# EasyEDA Pro project ProPrj_STC电调(AM32固件移植).epro

# Schematic v1.0
Board Name: am32ai8051u; Create Date: 2025-01-12; Page Name: P1; Project Name: STC电调(AM32固件移植); Schematic Name: v1.0; Update Date: 2025-01-12; Company: 嘉立创EDA; Page Size: A4; Version: V1.0
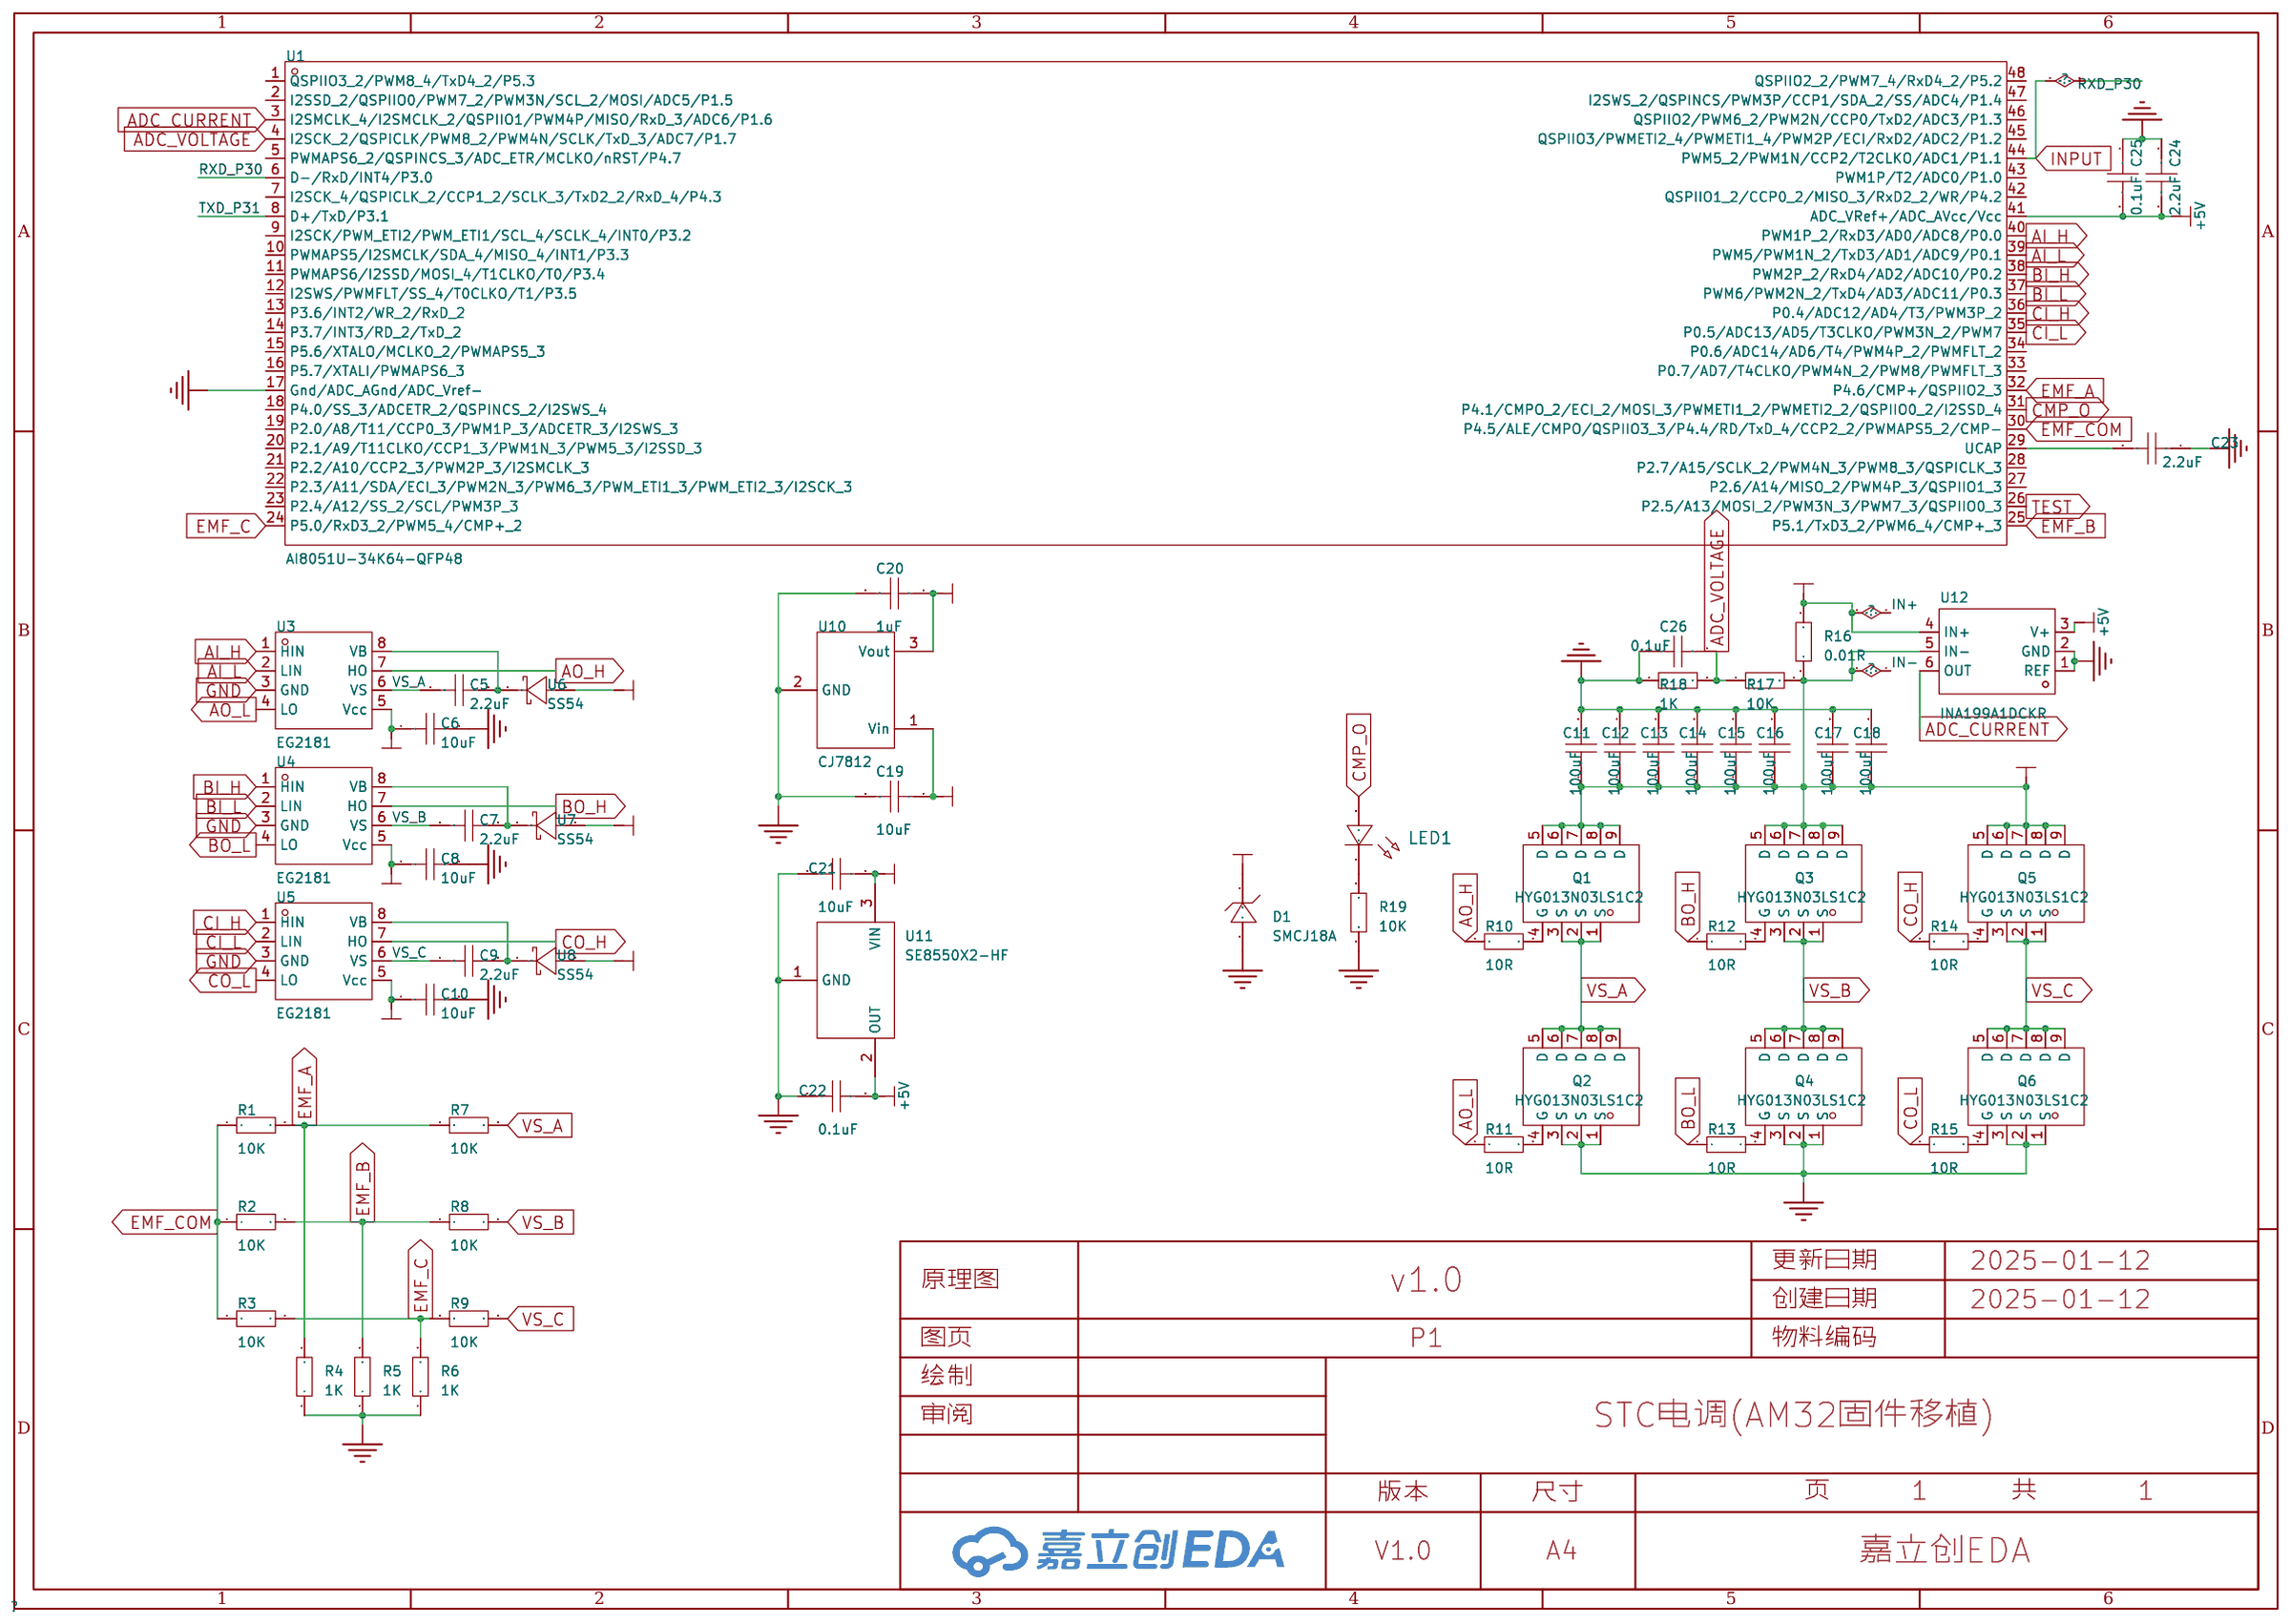
[diagram p0: schematic sheet]

## Parts
C5  2.2uF  [C0603]
C6  10uF  [C0603]
C7  2.2uF  [C0603]
C8  10uF  [C0603]
C9  2.2uF  [C0603]
C10  10uF  [C0603]
C11  100uF  [C1206]
C12  100uF  [C1206]
C13  100uF  [C1206]
C14  100uF  [C1206]
C15  100uF  [C1206]
C16  100uF  [C1206]
C17  100uF  [C1206]
C18  100uF  [C1206]
C19  10uF  [C0603]
C20  1uF  [C0603]
C21  10uF  [C0603]
C22  0.1uF  [C0603]
C23  2.2uF  [C0603]
C24  2.2uF  [C0603]
C25  0.1uF  [C0603]
C26  0.1uF  [C0603]
D1  SMCJ18A  [SMC_L6.9-W5.9-LS7.9-RD]
LED1  -  [LED_0603]
Q1  HYG013N03LS1C2  [PDFN-8_L5.8-W5.1-P1.27-LS6.1-BL]
Q2  HYG013N03LS1C2  [PDFN-8_L5.8-W5.1-P1.27-LS6.1-BL]
Q3  HYG013N03LS1C2  [PDFN-8_L5.8-W5.1-P1.27-LS6.1-BL]
Q4  HYG013N03LS1C2  [PDFN-8_L5.8-W5.1-P1.27-LS6.1-BL]
Q5  HYG013N03LS1C2  [PDFN-8_L5.8-W5.1-P1.27-LS6.1-BL]
Q6  HYG013N03LS1C2  [PDFN-8_L5.8-W5.1-P1.27-LS6.1-BL]
R1  10K  [R0603]
R2  10K  [R0603]
R3  10K  [R0603]
R4  1K  [R0603]
R5  1K  [R0603]
R6  1K  [R0603]
R7  10K  [R0603]
R8  10K  [R0603]
R9  10K  [R0603]
R10  10R  [R0603]
R11  10R  [R0603]
R12  10R  [R0603]
R13  10R  [R0603]
R14  10R  [R0603]
R15  10R  [R0603]
R16  0.01R  [R2010]
R17  10K  [R0603]
R18  1K  [R0603]
R19  10K  [R0603]
U1  AI8051U-34K64-QFP48  [LQFP-48_L7.0-W7.0-P0.50-LS9.0-BL_1]
U3  EG2181  [SOP-8_L4.9-W3.9-P1.27-LS6.0-BL]
U4  EG2181  [SOP-8_L4.9-W3.9-P1.27-LS6.0-BL]
U5  EG2181  [SOP-8_L4.9-W3.9-P1.27-LS6.0-BL]
U6  SS54  [SMA_L4.2-W2.6-LS5.1-RD]
U7  SS54  [SMA_L4.2-W2.6-LS5.1-RD]
U8  SS54  [SMA_L4.2-W2.6-LS5.1-RD]
U10  CJ7812  [TO-252-3_L6.5-W5.8-P4.58-BL]
U11  SE8550X2-HF  [SOT-23-3_L2.9-W1.3-P1.90-LS2.4-BR]
U12  INA199A1DCKR  [SC-70-6_L2.2-W1.3-P0.65-LS2.1-BR]

## Library data of the parts
C5-C10 C19-C26 = CAP_0603: Supplier Footprint: 0603
C11-C18 = CAP_1206: Supplier Footprint: 1206
D1 = SMCJ18A: 极性:单向;反向截止电压(Vrwm):18V;最大钳位电压:29.2V;峰值脉冲电流(Ipp):51.4A;峰值脉冲功率(Ppp):1.5kW;击穿电压:20V;; LCSC Part Name: TVS 18V截止 51.4A峰值脉冲; Supplier Part: C374030; Manufacturer: Littelfuse(美国力特); Supplier Footprint: DO-214AB(SMCJ); JLCPCB Part Class: 扩展库; Datasheet: https://atta.szlcsc.com/upload/public/pdf/source/20190918/C428836_E6B4B3834ADA1E56164A3D12F904E6C7.pdf; Supplier: LCSC; polarity: 单向; Reverse Stand-Off Voltage (Vrwm): 18V; Maximum Clamping Voltage: 29.2V; Peak Pulse Current (Ipp): 51.4A; Peak Pulse Power Dissipation (Ppp): 1.5kW; Breakdown Voltage: 20V; Type: TVS
LED1 = LED_0603-R: Supplier Footprint: 0603
Q1-Q6 = HYG013N03LS1C2: 类型:-;漏源电压(Vdss):30V;连续漏极电流(Id):150A;导通电阻(RDS(on)@Vgs,Id):2mΩ@4.5V,20A;功率:65W;阈值电压(Vgs(th)@Id):1V@250uA;; LCSC Part Name: 单通道N沟道MOSFET,电流:150A,耐压:30V; Supplier Part: C2763405; Manufacturer: HUAYI(华羿微); Supplier Footprint: PDFN-8(5.1x5.8); JLCPCB Part Class: 扩展库; Datasheet: https://atta.szlcsc.com/upload/public/pdf/source/20210326/C2763405_0A6080D7BBB9C26F30CE39A27C6AD564.pdf; Supplier: LCSC; Drain Source Voltage (Vdss): 30V; Continuous Drain Current (Id): 150A; Drain Source On Resistance (RDS(on)@Vgs,Id): 2mΩ@4.5V,20A; Power Dissipation (Pd): 65W; Gate Threshold Voltage (Vgs(th)@Id): 1V@250uA; Total Gate Charge (Qg@Vgs): 44.7nC@10V; Input Capacitance (Ciss@Vds): 3.011nF; Reverse Transfer Capacitance (Crss@Vds): 9.2pF@25V; Operating Temperature: -55℃~+175℃
R1-R15 R17-R19 = Res_0603: Supplier Footprint: 0603
R16 = Res_2010: Supplier Footprint: 2010
U1 = AI8051U-34K64-QFP48: 硬件浮点/硬件三角函数 跑100MHz, 32位8051-CPU 跑 42MHz，PWM 有硬件移相功能，DMA支持外设到外设，DMA支持PWM; Supplier Part: C41427635; Manufacturer: STC; Supplier Footprint: QFP-48; JLCPCB Part Class: 扩展库; Datasheet: https://atta.szlcsc.com/upload/public/pdf/source/20241012/98E0A3F17C9CC280218AE3F266CCDE47.pdf; Supplier: LCSC
U3-U5 = EG2181: Supplier Part: C459721; Manufacturer: EG(屹晶微); Supplier Footprint: SOP-8; JLCPCB Part Class: 扩展库; Datasheet: https://atta.szlcsc.com/upload/public/pdf/source/20191122/C459721_8DDE7F395482F041919AB19A4C4FD510.pdf; Supplier: LCSC
U6-U8 = SS54: Supplier Part: C9900023219; Supplier Footprint: (1N5824)DO-214; JLCPCB Part Class: 扩展库; Supplier: LCSC
U10 = CJ7812_C26184: 输出类型:固定;最大输入电压:35V;输出电压:12V;输出电流:1.5A;输出极性:正极;; LCSC Part Name: 输入35V 输出12V 1.5A; Supplier Part: C26184; Manufacturer: CJ(江苏长电/长晶); Supplier Footprint: TO-252-2; JLCPCB Part Class: 扩展库; Datasheet: https://atta.szlcsc.com/upload/public/pdf/source/20180412/C26184_C7F45D4504ECDF2F14935BA96F015906.pdf; Supplier: LCSC; Output Type: 固定; Maximum Input Voltage: 35V; Output Voltage: 12V; Output Current: 1.5A; Dropout Voltage: 2V@(1A); Output Polarity: 正极; Number of Outputs: 1
U11 = SE8550X2-HF: 输出类型:固定;最大输入电压:40V;输出电压:5V;最大输出电流:250mA;电源纹波抑制比(PSRR):85dB;输出极性:正极;; LCSC Part Name: 输入40V 输出5V 250mA; Supplier Part: C115015; Manufacturer: SEAWARD(思旺); Supplier Footprint: SOT-23; JLCPCB Part Class: 扩展库; Datasheet: https://atta.szlcsc.com/upload/public/pdf/source/20221228/060EFB5038ABEFFCA582915343CD15E2.pdf; Supplier: LCSC; Output Type: 固定; Maximum Input Voltage: 40V; Output Voltage: 5V; MAX Output Current: 250mA; Power Supply Rejection Ratio (PSRR): 85dB; Dropout Voltage: 600mV@(200mA); standby current: 2uA; Output Polarity: 正极; Number of Outputs: 1
U12 = INA199A1DCKR: INA199 26V、双向电流感应放大器; Supplier Part: C59135; Manufacturer: TI(德州仪器); Supplier Footprint: SOT-363(SC-70-6); JLCPCB Part Class: 扩展库; Datasheet: https://www.ti.com/cn/lit/gpn/ina199; Supplier: LCSC; Supply Voltage: -300mV~26V; Supply Current: 300uA; Operating Temperature: -40℃~+125℃

## Nets
+5V: C22.2 C24.2 C25.2 U1.41(ADC_VRef+/ADC_AVcc/Vcc) U11.2(OUT) U12.3(V+)
+12V: C6.1 C8.1 C10.1 C20.1 C21.1 U3.5(Vcc) U4.5(Vcc) U5.5(Vcc) U6.2(A) U7.2(A) U8.2(A) U10.3(Vout) U11.3(VIN)
GND: C6.2 C8.2 C10.2 C11.2 C12.2 C13.2 C14.2 C15.2 C16.2 C17.2 C18.2 C19.2 C20.2 C21.2 C22.1 C23.1 C24.1 C25.1 C26.1 D1.2(A) Q2.1(S) Q2.2(S) Q2.3(S) Q4.1(S) Q4.2(S) Q4.3(S) Q6.1(S) Q6.2(S) Q6.3(S) R4.1 R5.1 R6.1 R18.1 R19.1 U1.17(Gnd/ADC_AGnd/ADC_Vref-) U3.3(GND) U4.3(GND) U5.3(GND) U10.2(GND) U11.1(GND) U12.1(REF) U12.2(GND)
VBAT: C19.1 R16.1 U10.1(Vin) U12.4(IN+)
ADC_CURRENT: U1.3(I2SMCLK_4/I2SMCLK_2/QSPIIO1/PWM4P/MISO/RxD_3/ADC6/P1.6) U12.6(OUT)
ADC_VOLTAGE: C26.2 R17.1 R18.2 U1.4(I2SCK_2/QSPICLK/PWM8_2/PWM4N/SCLK/TxD_3/ADC7/P1.7)
AI_H: U1.40(PWM1P_2/RxD3/AD0/ADC8/P0.0) U3.1(HIN)
AI_L: U1.39(PWM5/PWM1N_2/TxD3/AD1/ADC9/P0.1) U3.2(LIN)
AO_H: R10.1 U3.7(HO)
AO_L: R11.1 U3.4(LO)
BI_H: U1.38(PWM2P_2/RxD4/AD2/ADC10/P0.2) U4.1(HIN)
BI_L: U1.37(PWM6/PWM2N_2/TxD4/AD3/ADC11/P0.3) U4.2(LIN)
BO_H: R12.1 U4.7(HO)
BO_L: R13.1 U4.4(LO)
CI_H: U1.36(P0.4/ADC12/AD4/T3/PWM3P_2) U5.1(HIN)
CI_L: U1.35(P0.5/ADC13/AD5/T3CLKO/PWM3N_2/PWM7) U5.2(LIN)
CMP_O: LED1.2(A) U1.31(P4.1/CMPO_2/ECI_2/MOSI_3/PWMETI1_2/PWMETI2_2/QSPIIO0_2/I2SSD_4)
CO_H: R14.1 U5.7(HO)
CO_L: R15.1 U5.4(LO)
EMF_A: R1.2 R4.2 R7.1 U1.32(P4.6/CMP+/QSPIIO2_3)
EMF_B: R2.2 R5.2 R8.1 U1.25(P5.1/TxD3_2/PWM6_4/CMP+_3)
EMF_C: R3.2 R6.2 R9.1 U1.24(P5.0/RxD3_2/PWM5_4/CMP+_2)
EMF_COM: R1.1 R2.1 R3.1 U1.30(P4.5/ALE/CMPO/QSPIIO3_3/P4.4/RD/TxD_4/CCP2_2/PWMAPS5_2/CMP-)
INPUT: U1.6(D-/RxD/INT4/P3.0) U1.44(PWM5_2/PWM1N/CCP2/T2CLKO/ADC1/P1.1)
TEST: U1.26(P2.5/A13/MOSI_2/PWM3N_3/PWM7_3/QSPIIO0_3)
TXD_P31: U1.8(D+/TxD/P3.1)
V_MOS: C11.1 C12.1 C13.1 C14.1 C15.1 C16.1 C17.1 C18.1 D1.1(C) Q1.5(D) Q1.6(D) Q1.7(D) Q1.8(D) Q1.9(D) Q3.5(D) Q3.6(D) Q3.7(D) Q3.8(D) Q3.9(D) Q5.5(D) Q5.6(D) Q5.7(D) Q5.8(D) Q5.9(D) R16.2 R17.2 U12.5(IN-)
VS_A: C5.1 Q1.1(S) Q1.2(S) Q1.3(S) Q2.5(D) Q2.6(D) Q2.7(D) Q2.8(D) Q2.9(D) R7.2 U3.6(VS)
VS_B: C7.1 Q3.1(S) Q3.2(S) Q3.3(S) Q4.5(D) Q4.6(D) Q4.7(D) Q4.8(D) Q4.9(D) R8.2 U4.6(VS)
VS_C: C9.1 Q5.1(S) Q5.2(S) Q5.3(S) Q6.5(D) Q6.6(D) Q6.7(D) Q6.8(D) Q6.9(D) R9.2 U5.6(VS)
$1N3291: Q2.4(G) R11.2
$1N3317: Q4.4(G) R13.2
$1N3367: Q6.4(G) R15.2
$1N3393: Q1.4(G) R10.2
$1N3419: Q3.4(G) R12.2
$1N3445: Q5.4(G) R14.2
$1N6248: C7.2 U4.8(VB) U7.1(C)
$1N6352: C9.2 U5.8(VB) U8.1(C)
$1N7183: C23.2 U1.29(UCAP)
$1N9300: C5.2 U3.8(VB) U6.1(C)
$1N11107: LED1.1(C) R19.2

Not connected (* = marked no-connect by the designer): U1 1(QSPIIO3_2/PWM8_4/TxD4_2/P5.3) 2(I2SSD_2/QSPIIO0/PWM7_2/PWM3N/SCL_2/MOSI/ADC5/P1.5) 5(PWMAPS6_2/QSPINCS_3/ADC_ETR/MCLKO/nRST/P4.7) 7(I2SCK_4/QSPICLK_2/CCP1_2/SCLK_3/TxD2_2/RxD_4/P4.3) 9(I2SCK/PWM_ETI2/PWM_ETI1/SCL_4/SCLK_4/INT0/P3.2) 10(PWMAPS5/I2SMCLK/SDA_4/MISO_4/INT1/P3.3) 11(PWMAPS6/I2SSD/MOSI_4/T1CLKO/T0/P3.4) 12(I2SWS/PWMFLT/SS_4/T0CLKO/T1/P3.5) 13(P3.6/INT2/WR_2/RxD_2) 14(P3.7/INT3/RD_2/TxD_2) 15(P5.6/XTALO/MCLKO_2/PWMAPS5_3) 16(P5.7/XTALI/PWMAPS6_3) 18(P4.0/SS_3/ADCETR_2/QSPINCS_2/I2SWS_4) 19(P2.0/A8/T11/CCP0_3/PWM1P_3/ADCETR_3/I2SWS_3) 20(P2.1/A9/T11CLKO/CCP1_3/PWM1N_3/PWM5_3/I2SSD_3) 21(P2.2/A10/CCP2_3/PWM2P_3/I2SMCLK_3) 22(P2.3/A11/SDA/ECI_3/PWM2N_3/PWM6_3/PWM_ETI1_3/PWM_ETI2_3/I2SCK_3) 23(P2.4/A12/SS_2/SCL/PWM3P_3) 27(P2.6/A14/MISO_2/PWM4P_3/QSPIIO1_3) 28(P2.7/A15/SCLK_2/PWM4N_3/PWM8_3/QSPICLK_3) 33(P0.7/AD7/T4CLKO/PWM4N_2/PWM8/PWMFLT_3) 34(P0.6/ADC14/AD6/T4/PWM4P_2/PWMFLT_2) 42(QSPIIO1_2/CCP0_2/MISO_3/RxD2_2/WR/P4.2) 43(PWM1P/T2/ADC0/P1.0) 45(QSPIIO3/PWMETI2_4/PWMETI1_4/PWM2P/ECI/RxD2/ADC2/P1.2) 46(QSPIIO2/PWM6_2/PWM2N/CCP0/TxD2/ADC3/P1.3) 47(I2SWS_2/QSPINCS/PWM3P/CCP1/SDA_2/SS/ADC4/P1.4) 48(QSPIIO2_2/PWM7_4/RxD4_2/P5.2)

# Board v1.0
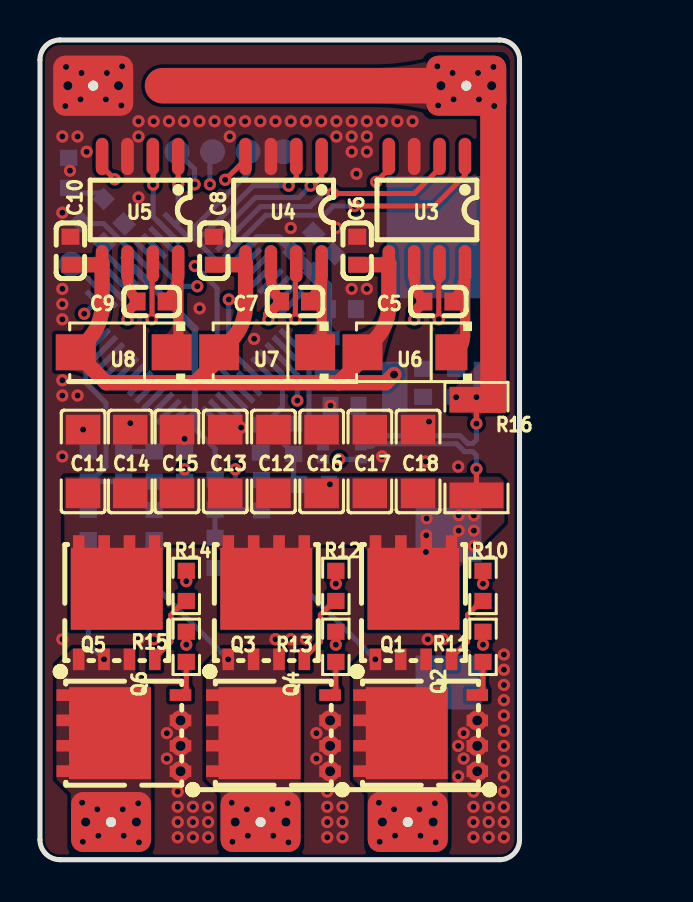
[diagram p1: board, top side]
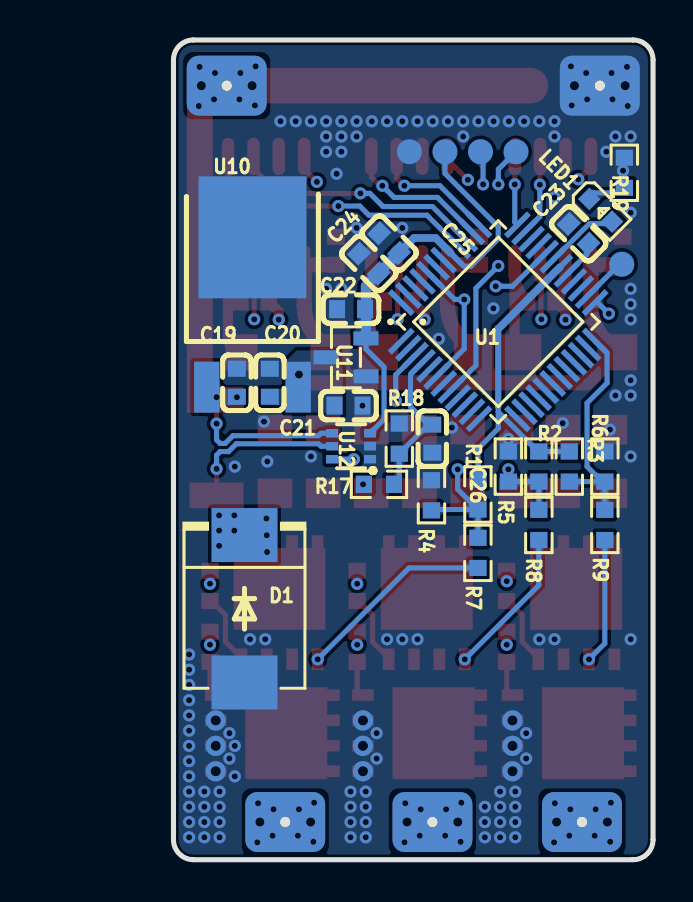
[diagram p2: board, bottom side, seen from below]

Outline 24 x 41 mm; copper layers: Top Layer, Inner1, Inner2, Bottom Layer. Coordinates in mm from the lower left corner of the outline.
Outline path: 0,40 0,1 arc(0.29,0.29) 1,0 23,0 arc(23.71,0.29) 24,1 24,40 arc(23.71,40.71) 23,41 1,41 arc(0.29,40.71) 0,40
Stack: Top Layer 0.035mm 外层铜厚1oz / Dielectric1 0.2104mm 7628 RC49% 8.6mil / Inner1 0.0152mm 内层铜厚 / Dielectric2 1.065mm 1.1mm H/HOZ Copper / Inner2 0.0152mm 内层铜厚 / Dielectric3 0.2104mm 7628 RC49% 8.6mil / Bottom Layer 0.035mm 外层铜厚1oz

## Design rules (mm)
template: 用户自定义配置
spacing copperThickness1oz (default): track to track 0.102, other pairs 0.152 to 0.3
spacing copperThickness2oz: track to track 0.203, other pairs 0.152 to 0.3
track width copperThickness1oz (default): min 0.127, default 0.254, max 2.54
track width copperThickness2oz: min 0.203, default 0.254, max 2.54
differential pair differentialPair (default): width min 0.127, default 0.254, max 2.54; gap min 0.152, default 0.152
via viaSize (default): diameter min 0.5, default 0.61, max 10; hole min 0.3, default 0.305, max 6.299

## Placement (name value [footprint] x y rotation side)
C5  2.2uF  [C0603]  19.94 27.92 0 top
C6  10uF  [C0603]  15.88 30.46 90 top
C7  2.2uF  [C0603]  12.77 27.92 0 top
C8  10uF  [C0603]  8.7 30.46 90 top
C9  2.2uF  [C0603]  5.59 27.92 0 top
C10  10uF  [C0603]  1.52 30.46 90 top
C11  100uF  [C1206]  2.16 19.92 90 top
C12  100uF  [C1206]  11.68 19.92 90 top
C13  100uF  [C1206]  9.27 19.92 90 top
C14  100uF  [C1206]  4.52 19.92 90 top
C15  100uF  [C1206]  6.86 19.92 90 top
C16  100uF  [C1206]  14.1 19.92 90 top
C17  100uF  [C1206]  16.51 19.92 90 top
C18  100uF  [C1206]  18.92 19.92 90 top
C19  10uF  [C0603]  20.83 23.85 90 bottom
C20  1uF  [C0603]  19.18 23.85 90 bottom
C21  10uF  [C0603]  15.24 22.71 180 bottom
C22  0.1uF  [C0603]  15.11 27.54 180 bottom
C23  2.2uF  [C0603]  3.72 31.31 225 bottom
C24  2.2uF  [C0603]  14.22 29.82 225 bottom
C25  0.1uF  [C0603]  13.21 30.84 225 bottom
C26  0.1uF  [C0603]  11.05 21.06 90 bottom
D1  SMCJ18A  [SMC_L6.9-W5.9-LS7.9-RD]  20.45 12.55 270 bottom
LED1  -  [LED_0603]  2.58 32.45 225 bottom
NOREF  -  [Pad_e2281]  21.34 38.71 0 top
NOREF#2  -  [Pad_e2202]  22.68 30.35 180 top
NOREF#3  -  [Pad_e1605]  6.86 35.41 180 top
NOREF#4  -  [Pad_e1625]  8.64 35.41 180 top
NOREF#5  -  [Pad_e1356]  3.56 1.88 0 top
NOREF#6  -  [Pad_e1747]  12.19 35.41 180 top
NOREF#7  -  [Pad_e2259]  2.66 38.71 180 top
NOREF#8  -  [Pad_e1699]  10.41 35.41 180 top
NOREF#9  -  [Pad_e1433]  11.04 1.88 0 top
NOREF#10  -  [Pad_e11]  1.56 29.78 180 top
NOREF#11  -  [Pad_e1444]  18.41 1.88 0 top
Q1  HYG013N03LS1C2  [PDFN-8_L5.8-W5.1-P1.27-LS6.1-BL]  18.69 12.86 0 top
Q2  HYG013N03LS1C2  [PDFN-8_L5.8-W5.1-P1.27-LS6.1-BL]  19.05 6.33 90 top
Q3  HYG013N03LS1C2  [PDFN-8_L5.8-W5.1-P1.27-LS6.1-BL]  11.33 12.86 0 top
Q4  HYG013N03LS1C2  [PDFN-8_L5.8-W5.1-P1.27-LS6.1-BL]  11.68 6.33 90 top
Q5  HYG013N03LS1C2  [PDFN-8_L5.8-W5.1-P1.27-LS6.1-BL]  3.84 12.86 0 top
Q6  HYG013N03LS1C2  [PDFN-8_L5.8-W5.1-P1.27-LS6.1-BL]  4.2 6.33 90 top
R1  10K  [R0603]  8.76 18.27 270 bottom
R2  10K  [R0603]  5.72 19.66 270 bottom
R3  10K  [R0603]  4.19 19.66 270 bottom
R4  1K  [R0603]  11.09 18.23 270 bottom
R5  1K  [R0603]  7.24 19.66 270 bottom
R6  1K  [R0603]  2.41 19.66 270 bottom
R7  10K  [R0603]  8.76 15.35 270 bottom
R8  10K  [R0603]  5.72 16.74 270 bottom
R9  10K  [R0603]  2.41 16.74 270 bottom
R10  10R  [R0603]  22.17 13.69 270 top
R11  10R  [R0603]  22.17 10.65 270 top
R12  10R  [R0603]  14.81 13.69 270 top
R13  10R  [R0603]  14.81 10.65 270 top
R14  10R  [R0603]  7.32 13.69 270 top
R15  10R  [R0603]  7.32 10.65 270 top
R16  0.01R  [R2010]  21.84 20.62 270 top
R17  10K  [R0603]  13.72 18.77 0 bottom
R18  1K  [R0603]  12.7 21.06 270 bottom
R19  10K  [R0603]  1.44 34.36 270 bottom
U1  AI8051U-34K64-QFP48  [LQFP-48_L7.0-W7.0-P0.50-LS9.0-BL_1]  7.75 26.9 225 bottom
U3  EG2181  [SOP-8_L4.9-W3.9-P1.27-LS6.0-BL]  19.37 32.49 180 top
U4  EG2181  [SOP-8_L4.9-W3.9-P1.27-LS6.0-BL]  12.19 32.49 180 top
U5  EG2181  [SOP-8_L4.9-W3.9-P1.27-LS6.0-BL]  5.01 32.49 180 top
U6  SS54  [SMA_L4.2-W2.6-LS5.1-RD#2]  18.54 25.38 180 top
U7  SS54  [SMA_L4.2-W2.6-LS5.1-RD]  11.37 25.38 180 top
U8  SS54  [SMA_L4.2-W2.6-LS5.1-RD]  4.19 25.38 180 top
U10  CJ7812  [TO-252-3_L6.5-W5.8-P4.58-BL]  20.05 27.38 180 bottom
U11  SE8550X2-HF  [SOT-23-3_L2.9-W1.3-P1.90-LS2.4-BR]  15.37 25.12 180 bottom
U12  INA199A1DCKR  [SC-70-6_L2.2-W1.3-P0.65-LS2.1-BR]  15.11 20.68 180 bottom

## Footprints (pads in the part's own frame, mm; a bottom-side part is the same pattern mirrored in y, then rotated)
C0603
  rect 0.8x0.9 smd: 1(-0.7,0) 2(0.7,0)
C1206
  rect 1.485x1.728 smd: 1(-1.593,0) 2(1.593,0)
LED_0603
  rect 0.8x0.8 smd: 1(-0.851,-0.01) 2(0.75,-0.005)
LQFP-48_L7.0-W7.0-P0.50-LS9.0-BL_1
  rect 0.28x1.62 smd: 1(-2.75,-4.11) 2(-2.25,-4.11) 3(-1.75,-4.11) 4(-1.25,-4.11) 5(-0.75,-4.11) 6(-0.25,-4.11) 7(0.25,-4.11) 8(0.75,-4.11) 9(1.25,-4.11) 10(1.75,-4.11) 11(2.25,-4.11) 12(2.75,-4.11) 25(2.75,4.11) 26(2.25,4.11) 27(1.75,4.11) 28(1.25,4.11) 29(0.75,4.11) 30(0.25,4.11) 31(-0.25,4.11) 32(-0.75,4.11) 33(-1.25,4.11) 34(-1.75,4.11) 35(-2.25,4.11) 36(-2.75,4.11)
  rect 1.62x0.28 smd: 13(4.11,-2.75) 14(4.11,-2.25) 15(4.11,-1.75) 16(4.11,-1.25) 17(4.11,-0.75) 18(4.11,-0.25) 19(4.11,0.25) 20(4.11,0.75) 21(4.11,1.25) 22(4.11,1.75) 23(4.11,2.25) 24(4.11,2.75) 37(-4.11,2.75) 38(-4.11,2.25) 39(-4.11,1.75) 40(-4.11,1.25) 41(-4.11,0.75) 42(-4.11,0.25) 43(-4.11,-0.25) 44(-4.11,-0.75) 45(-4.11,-1.25) 46(-4.11,-1.75) 47(-4.11,-2.25) 48(-4.11,-2.75)
Pad_e11
  round 1.25 smd far side: 1(0,0)
Pad_e1356
  rrect 4x3 hole 0.508: 1(0,0)
Pad_e1433
  rrect 4x3 hole 0.508: 1(0,0)
Pad_e1444
  rrect 4x3 hole 0.508: 1(0,0)
Pad_e1605
  round 1.25 smd far side: 1(0,0)
Pad_e1625
  round 1.25 smd far side: 1(0,0)
Pad_e1699
  round 1.25 smd far side: 1(0,0)
Pad_e1747
  round 1.25 smd far side: 1(0,0)
Pad_e2202
  rect 1.3x16 smd: 1(0,0)
Pad_e2259
  rrect 4x3 hole 0.508: 1(0,0)
Pad_e2281
  rrect 4x3 hole 0.508: 1(0,0)
PDFN-8_L5.8-W5.1-P1.27-LS6.1-BL
  rect 0.58x1.079 smd: 1(-1.905,-2.834) 2(-0.635,-2.834) 3(0.635,-2.834) 4(1.905,-2.834)
  rect 0.58x1.08 smd: 5(1.9,2.834) 6(0.64,2.834) 7(-0.63,2.834) 8(-1.9,2.834)
  rect 4.6x4.1 smd: 9(0,0.695)
R0603
  rect 0.806x0.864 smd: 1(-0.753,0) 2(0.753,0)
R2010
  rect 1.282x2.7 smd: 1(-2.391,0) 2(2.391,0)
SC-70-6_L2.2-W1.3-P0.65-LS2.1-BR
  rect 0.6x0.42 smd: 1(0.95,-0.65) 2(0.95,0) 3(0.95,0.65) 4(-0.95,0.65) 5(-0.95,0) 6(-0.95,-0.65)
SMA_L4.2-W2.6-LS5.1-RD
  rect 2x1.8 smd: 1(-2.4,0) 2(2.4,0)
SMA_L4.2-W2.6-LS5.1-RD#2
  rect 1.6x1.8 smd: 1(-2.051,0)
  rect 2x1.8 smd: 2(2.4,0)
SMC_L6.9-W5.9-LS7.9-RD
  rect 2.7x3.3 smd: 1(-3.687,0) 2(3.687,0)
SOP-8_L4.9-W3.9-P1.27-LS6.0-BL
  oval 0.63x1.865 smd: 1(-1.905,-2.683) 2(-0.635,-2.683) 3(0.635,-2.683) 4(1.905,-2.683) 5(1.905,2.683) 6(0.635,2.683) 7(-0.635,2.683) 8(-1.905,2.683)
SOT-23-3_L2.9-W1.3-P1.90-LS2.4-BR
  rect 1.25x0.7 smd: 1(1,-0.95) 2(1,0.95) 3(-1,0)
TO-252-3_L6.5-W5.8-P4.58-BL
  rect 1.27x2.54 smd: 1(-2.288,-3.747) 3(2.288,-3.745)
  rect 5.4x6.1 smd: 2(-0.002,3.747)

## Nets
+5V: C22.2 C24.2 C25.2 NOREF#8.1 U1.41 U11.2 U12.3
+12V: C6.1 C8.1 C10.1 C20.1 C21.1 U3.5 U4.5 U5.5 U6.2 U7.2 U8.2 U10.3 U11.3
GND: C6.2 C8.2 C10.2 C11.2 C12.2 C13.2 C14.2 C15.2 C16.2 C17.2 C18.2 C19.2 C20.2 C21.2 C22.1 C23.1 C24.1 C25.1 C26.1 D1.2 NOREF#6.1 NOREF#7.1 Q2.1 Q2.2 Q2.3 Q4.1 Q4.2 Q4.3 Q6.1 Q6.2 Q6.3 R4.1 R5.1 R6.1 R18.1 R19.1 U1.17 U3.3 U4.3 U5.3 U10.2 U11.1 U12.1 U12.2
VBAT: C19.1 NOREF.1 NOREF#2.1 R16.1 U10.1 U12.4
ADC_CURRENT: U1.3 U12.6
ADC_VOLTAGE: C26.2 R17.1 R18.2 U1.4
AI_H: U1.40 U3.1
AI_L: U1.39 U3.2
AO_H: R10.1 U3.7
AO_L: R11.1 U3.4
BI_H: U1.38 U4.1
BI_L: U1.37 U4.2
BO_H: R12.1 U4.7
BO_L: R13.1 U4.4
CI_H: U1.36 U5.1
CI_L: U1.35 U5.2
CMP_O: LED1.2 U1.31
CO_H: R14.1 U5.7
CO_L: R15.1 U5.4
EMF_A: R1.2 R4.2 R7.1 U1.32
EMF_B: R2.2 R5.2 R8.1 U1.25
EMF_C: R3.2 R6.2 R9.1 U1.24
EMF_COM: R1.1 R2.1 R3.1 U1.30
INPUT: NOREF#4.1 U1.6 U1.44
TEST: NOREF#10.1 U1.26
TXD_P31: NOREF#3.1 U1.8
V_MOS: C11.1 C12.1 C13.1 C14.1 C15.1 C16.1 C17.1 C18.1 D1.1 Q1.5 Q1.6 Q1.7 Q1.8 Q1.9 Q3.5 Q3.6 Q3.7 Q3.8 Q3.9 Q5.5 Q5.6 Q5.7 Q5.8 Q5.9 R16.2 R17.2 U12.5
VS_A: C5.1 NOREF#11.1 Q1.1 Q1.2 Q1.3 Q2.5 Q2.6 Q2.7 Q2.8 Q2.9 R7.2 U3.6
VS_B: C7.1 NOREF#9.1 Q3.1 Q3.2 Q3.3 Q4.5 Q4.6 Q4.7 Q4.8 Q4.9 R8.2 U4.6
VS_C: C9.1 NOREF#5.1 Q5.1 Q5.2 Q5.3 Q6.5 Q6.6 Q6.7 Q6.8 Q6.9 R9.2 U5.6
$1N3291: Q2.4 R11.2
$1N3317: Q4.4 R13.2
$1N3367: Q6.4 R15.2
$1N3393: Q1.4 R10.2
$1N3419: Q3.4 R12.2
$1N3445: Q5.4 R14.2
$1N6248: C7.2 U4.8 U7.1
$1N6352: C9.2 U5.8 U8.1
$1N7183: C23.2 U1.29
$1N9300: C5.2 U3.8 U6.1
$1N11107: LED1.1 R19.2

Pads without a net: U1 1 2 5 7 9 10 11 12 13 14 15 16 18 19 20 21 22 23 27 28 33 34 42 43 45 46 47 48

## Via types
v1: diameter 0.61, hole 0.305, Top Layer to Bottom Layer, 198 vias
v2: diameter 1.016, hole 0.508, Top Layer to Bottom Layer, 9 vias
v3: diameter 1.016, hole 0.457, Top Layer to Bottom Layer, 10 vias
v4: diameter 0.61, hole 0.4, Top Layer to Bottom Layer, 1 via

## Routing (per net, layer and track width the routed paths; a pad name or vN(x,y) marks a point on that pad's centre or on a via; arc(x,y) is an arc through that point)
+5V: length 22.3
  Bottom Layer w0.254: U11.2 14.37,25.54 13.46,24.64 13.46,22.03 U12.3 ; U1.41 9.47,29.69 9.11,29.69 7.75,31.05 7.75,31.66 10.41,34.33 NOREF#8.1
  Bottom Layer w0.381: 12.71,30.34 11.96,31.09 10.88,31.09 U1.41
  Bottom Layer w0.508: U11.2 14.37,28.69 12.71,30.34
+12V: length 40.1
  Top Layer w0.762: 14.95,23.85 16.14,25.05 ; 14.95,23.85 7.77,23.85 ; 14.95,23.85 17.31,23.85 v4(17.72,24.27) ; 8.7,29.76 10.17,29.76 arc(10.23,29.77) U4.5 10.29,27.75 arc(10.09,26.78) 9.54,25.95 U7.2 9.13,25.22 7.77,23.85 ; 7.77,23.85 3.31,23.85 U8.2 2.37,25.95 arc(2.92,26.78) 3.11,27.75 U5.5 arc(3.05,29.77) 2.99,29.76 1.52,29.76 ; 15.88,29.76 17.34,29.76 arc(17.41,29.77) U3.5 17.46,27.75 arc(17.27,26.78) 16.72,25.95 U6.2 16.14,25.26
GND:
  vias: v1(1.12,36.17) v1(1.12,32.36) v1(1.12,28.55) v1(1.12,27.79) v1(1.12,27.03) v1(1.12,23.98) v1(1.12,23.22) v1(1.12,20.17) v1(1.12,11.03) v1(1.27,37.7) v1(1.31,39.65) v1(1.5,34.46) v1(1.88,36.17) v1(1.88,23.22) v1(2.08,39.35) v1(2.03,38.03) v1(2.16,21.51) v1(2.34,35.41) v1(3.35,39.35) v1(3.3,38.03) v1(4.07,37.73) v1(4.11,39.68) v1(4.52,21.83) v1(4.93,36.93) v1(4.93,36.17) v1(4.93,33.12) v1(4.93,11.03) v1(5.69,36.93) v1(5.69,11.03) v1(6.35,6.33) v1(6.35,5.06) v1(6.45,36.93) v1(6.89,3.41) v1(6.89,2.64) v1(6.89,1.88) v1(6.89,1.12) v1(7.22,36.93) v1(7.24,21.05) v1(7.66,3.41) v1(7.66,2.64) v1(7.66,1.88) v1(7.66,1.12) v1(7.98,36.93) v1(7.99,27.58) v1(8.42,2.64) v1(8.42,1.88) v1(8.42,1.12) v1(8.74,36.93) v1(9.5,36.93) v1(9.5,36.17) v1(10.07,21.61) v1(10.26,36.93) v1(10.72,26.05) v1(11.03,36.93) v1(11.79,36.93) v1(11.79,11.03) v1(12.55,36.93) v1(12.55,31.6) v1(12.55,11.03) v1(13.31,36.93) v1(13.31,11.03) v1(13.83,6.33) v1(13.83,5.06) v1(14.07,36.93) v1(14.38,3.41) v1(14.38,2.64) v1(14.38,1.88) v1(14.38,1.12) v1(14.54,22.71) v1(14.84,36.93) v1(14.84,36.17) v1(14.84,31.6) v1(15.14,3.41) v1(15.14,2.64) v1(15.14,1.88) v1(15.14,1.12) v1(15.6,36.93) v1(15.6,36.17) v1(15.6,35.41) v1(15.6,28.55) v1(15.84,34.31) v1(16.36,36.93) v1(16.36,36.17) v1(16.36,35.41) v1(16.36,28.55) v1(17.12,36.93) v1(17.12,20.17) v1(17.88,36.93) v1(18.65,36.93) v1(19.3,19.92) v1(19.47,21.91) v1(19.41,11.03) v1(20.17,11.03) v1(20.93,19.66) v1(20.93,5.69) v1(20.93,4.17) v1(21.2,6.33) v1(21.2,5.06) v1(21.69,3.41) v1(21.69,2.64) v1(21.69,1.88) v1(21.69,1.12) v1(22.46,3.41) v1(22.46,2.64) v1(22.46,1.88) v1(22.46,1.12) v1(23.22,10.26) v1(23.22,9.5) v1(23.22,8.74) v1(23.22,7.98) v1(23.22,7.22) v1(23.22,6.45) v1(23.22,5.69) v1(23.22,4.93) v1(23.22,4.17) v1(23.22,3.41) v1(23.22,2.64) v1(23.22,1.88) v1(23.22,1.12) v2(7.03,6.96) v2(7.03,5.69) v2(7.03,4.42) v2(14.52,6.96) v2(14.52,5.69) v2(14.52,4.42) v2(21.89,6.96) v2(21.89,5.69) v2(21.89,4.42) v3(1.39,38.71) v3(3.93,38.71)
VBAT: length 23.4
  Top Layer w0.254: v1(21.84,23.13) v1(21.84,21.81)
  Top Layer w1.524: v3(20.07,38.71) NOREF.1
  Top Layer w1.778: 6.14,38.71 v3(20.07,38.71)
  Bottom Layer w0.254: v1(21.84,21.81) 21.84,21 21.66,20.82 21.41,20.82 21.02,21.21 16.74,21.21 16.62,21.33 U12.4
  vias: v1(19.89,39.68) v1(19.93,37.73) v1(20.65,39.35) v1(20.7,38.03) v1(20.83,23.13) v1(21.92,39.35) v1(21.97,38.03) v1(22.69,39.65) v1(22.73,37.7) v3(22.61,38.71)
ADC_CURRENT: length 7.6
  Inner2 w0.381: v1(14.97,20.03) 12.88,22.12 v1(12.88,22.97)
  Bottom Layer w0.254: U1.3 12.88,24.25 v1(12.88,22.97) ; U12.6 v1(14.97,20.03)
ADC_VOLTAGE: length 7.6
  Bottom Layer w0.254: 11.24,21.76 12.13,22.65 12.13,24.28 U1.4 ; 11.24,21.76 C26.2 ; 11.24,21.76 11.25,21.76 R18.2 12.7,19.04 R17.1
AI_H: length 13.9
  Top Layer w0.254: v1(15.75,32.69) 19.74,32.69 21.27,34.22 U3.1
  Bottom Layer w0.254: 9.77,30.69 11.31,32.24 14.22,32.24 14.68,32.69 v1(15.75,32.69)
AI_L: length 12.6
  Top Layer w0.254: U3.2 20,34.58 18.74,33.32 14.66,33.32 v1(14.65,33.33)
  Bottom Layer w0.254: v1(14.65,33.33) 14.17,33.33 13.51,32.67 11.04,32.67 U1.39
AO_H: length 17.6
  Top Layer w0.254: U3.7 19.96,29.77 v1(19.96,27.03) ; R10.1 v1(22.17,13.8)
  Inner2 w0.381: v1(22.17,13.8) 20.18,15.8 20.18,26.81 v1(19.96,27.03)
AO_L: length 28.1
  Top Layer w0.254: v1(22.17,10.75) R11.1 ; U3.4 17.46,34.54 v1(16.83,33.9)
  Inner2 w0.381: v1(16.83,33.9) 16.83,31.08 22.82,25.08 22.82,11.4 v1(22.17,10.75)
BI_H: length 7.2
  Top Layer w0.254: v1(13.55,33.71) 13.67,33.71 14.09,34.14 14.09,35.17
  Bottom Layer w0.254: v1(13.55,33.71) 12.96,33.13 10.79,33.13 U1.38
BI_L: length 6.2
  Top Layer w0.254: v1(12.45,33.71) 12.82,34.09 12.82,35.17
  Bottom Layer w0.254: v1(12.45,33.71) 10.67,33.71 U1.37
BO_H: length 18
  Top Layer w0.254: v1(12.78,27.03) 12.78,29.77 12.82,29.81 ; R12.1 v1(14.81,13.8)
  Inner2 w0.381: v1(14.81,13.8) 12.23,16.38 12.23,26.48 v1(12.78,27.03)
BO_L: length 29
  Top Layer w0.254: v1(14.81,10.75) R13.1 ; v1(9.27,34.01) 10.16,34.9 10.28,34.9 10.28,35.17
  Inner2 w0.381: v1(14.81,10.75) 16.17,12.11 16.17,25.21 9.27,32.11 v1(9.27,34.01)
CI_H: length 3.5
  Top Layer w0.254: 6.92,33.78 U5.1
  Bottom Layer w0.254: 6.92,33.78 6.92,31.89 U1.36
  vias: v1(6.92,33.78)
CI_L: length 4.1
  Top Layer w0.254: U5.2 5.66,35.16 v1(5.66,33.76)
  Bottom Layer w0.254: U1.35 5.66,32.17 v1(5.66,33.76)
CMP_O: length 3.6
  Bottom Layer w0.254: 5.02,29.99 3.18,31.82 2.29,31.82 2.23,31.87
CO_H: length 17.1
  Top Layer w0.254: v1(5.59,27.03) 5.61,27.05 5.61,29.77 U5.7 ; R14.1 v1(7.32,13.93)
  Inner2 w0.381: v1(5.59,27.03) 5.6,27.02 5.6,15.65 v1(7.32,13.93)
CO_L: length 27.6
  Top Layer w0.254: U5.4 3.11,34.67 v1(3.74,34.03) ; v1(7.32,10.75) R15.1
  Inner2 w0.381: v1(3.74,34.03) 3.74,30.91 8.25,26.39 8.25,11.69 v1(7.32,10.75)
EMF_A: length 19.3
  Inner2 w0.381: v1(9.78,19.52) 9.18,20.12 9.18,27.37 v1(7.87,28.68)
  Bottom Layer w0.254: 5.37,30.34 7.03,28.68 v1(7.87,28.68) ; R7.1 R1.2 ; R1.2 9.78,18.53 v1(9.78,19.52) ; R1.2 11.05,17.51 R4.2
EMF_B: length 17.1
  Inner2 w0.381: v1(2.21,27.31) 2.66,27.75 5.78,27.75 6.39,27.15 6.39,20.37 6.97,19.78 6.98,19.78 v1(7.24,19.52)
  Bottom Layer w0.254: v1(7.24,19.52) R5.2 R2.2 R8.1 ; U1.25 2.77,27.86 v1(2.21,27.31)
EMF_C: length 11.3
  Bottom Layer w0.254: 2.67,17.5 2.41,17.75 R6.2 2.55,18.91 ; R3.2 2.55,18.91 ; 2.55,18.91 3.3,19.66 3.3,22.84 2.3,23.84 2.3,25.34 U1.24
EMF_COM: length 16.7
  Bottom Layer w0.254: 7.75,22.4 5.77,20.42 R2.1 R3.1 ; 7.75,22.4 7.75,22.66 7.76,22.66 ; 7.75,22.4 7.75,21.57 8.76,20.55 R1.1
  Bottom Layer w0.305: 7.76,26.56 7.75,26.55 7.75,22.68 7.76,22.66
  Bottom Layer w0.381: U1.30 7.73,26.56 7.76,26.56
INPUT: length 14.5
  Inner2 w0.254: 8.5,33.76 8.5,28.96 v1(9.45,28.02)
  Bottom Layer w0.254: NOREF#4.1 8.5,35.28 8.5,33.76 ; 11.18,29.28 9.93,28.02 v1(9.45,28.02) 9.45,25.55 U1.6
  vias: v1(8.5,33.78)
TEST: length 2.4
  Bottom Layer w0.254: 1.52,29.76 1.71,29.76 U1.26
TXD_P31: length 13.3
  Inner2 w0.254: v1(7.74,33.78) 7.75,33.77 v1(7.75,29.7)
  Bottom Layer w0.254: v1(7.75,29.7) 8.87,28.58 8.87,24.72 U1.8 ; NOREF#3.1 7.74,34.53 v1(7.74,33.78)
V_MOS: length 8.1
  Top Layer w0.254: R16.2 v1(21.84,19.55)
  Bottom Layer w0.254: v1(21.84,19.55) 21.84,20.23 21.66,20.41 21.24,20.41 20.85,20.8 16.74,20.8 16.62,20.68 U12.5
  vias: v1(14.51,18.77) v1(19.35,17.07) v1(19.33,16.23) v1(19.32,15.39) v1(20.96,17.22) v1(20.96,16.46) v1(21.72,17.22) v1(21.72,16.46) v1(21.72,15.7)
VS_A: length 30.9
  Top Layer w0.508: U3.6 18.73,29.15 arc(18.86,28.48) 19.24,27.92 18.73,27.41 v1(18.73,27.01)
  Inner2 w0.508: v1(18.73,27.01) 18.43,26.71 18.43,11.67 v1(16.78,10.02)
  Bottom Layer w0.254: R7.2 12.21,14.59 v1(16.78,10.02)
  vias: v1(16.96,2.85) v1(17,0.9) v1(17.72,2.52) v1(17.77,1.2) v1(18.99,2.52) v1(19.04,1.2) v1(19.77,2.82) v1(19.8,0.87) v3(17.14,1.88) v3(19.68,1.88)
VS_B: length 28.5
  Top Layer w0.508: v1(11.43,27.01) 11.43,27.28 C7.1 arc(11.69,28.48) 11.56,29.15 U4.6
  Inner2 w0.508: v1(9.42,10.02) 11.43,12.03 v1(11.43,27.01)
  Bottom Layer w0.254: R8.2 5.72,13.73 v1(9.42,10.02)
  vias: v1(9.59,2.85) v1(9.63,0.9) v1(10.36,2.52) v1(10.41,1.2) v1(11.63,2.52) v1(11.68,1.2) v1(12.4,2.82) v1(12.44,0.87) v3(9.77,1.88) v3(12.31,1.88)
VS_C: length 26.9
  Top Layer w0.508: U5.6 4.38,29.15 arc(4.51,28.48) C9.1 4.38,27.41 v1(4.38,27.01)
  Inner2 w0.508: v1(4.38,27.01) 3.81,26.44 3.81,10.62 v1(3.21,10.02)
  Bottom Layer w0.254: v1(3.21,10.02) 2.41,10.82 R9.2
  vias: v1(2.11,2.85) v1(2.15,0.9) v1(2.87,2.52) v1(2.92,1.2) v1(4.14,2.52) v1(4.19,1.2) v1(4.92,2.82) v1(4.95,0.87) v3(2.29,1.88) v3(4.83,1.88)
$1N3291: length 1.8
  Top Layer w0.254: R11.2 22.17,8.52 Q2.4
$1N3317: length 1.8
  Top Layer w0.254: R13.2 14.81,8.52 Q4.4
$1N3367: length 1.8
  Top Layer w0.254: Q6.4 7.32,8.52 R15.2
$1N3393: length 3.6
  Top Layer w0.254: Q1.4 20.6,10.1 21.4,10.9 21.4,12.24 22.1,12.94 R10.2
$1N3419: length 3.6
  Top Layer w0.254: R12.2 14.73,12.94 14.03,12.24 14.03,10.9 13.23,10.1 Q3.4
$1N3445: length 3.6
  Top Layer w0.254: R14.2 7.25,12.94 6.55,12.24 6.55,10.9 5.75,10.1 Q5.4
$1N6248: length 6.2
  Top Layer w0.508: U4.8 14.1,29.44 ; 14.1,29.44 14.11,29.43 14.11,26.18 14.1,26.17 arc(14.01,25.74) U7.1 ; 14.1,29.44 arc(13.93,28.62) C7.2
$1N6352: length 6.2
  Top Layer w0.508: U5.8 6.92,29.44 ; 6.92,29.44 6.93,29.43 6.93,26.18 6.92,26.17 arc(6.83,25.74) U8.1 ; 6.92,29.44 arc(6.75,28.62) C9.2
$1N7183: length 2
  Bottom Layer w0.254: 4.31,29.28 3.31,30.27 3.31,30.85
$1N9300: length 6.2
  Top Layer w0.508: 21.27,29.44 21.28,29.43 21.28,26.18 21.27,26.17 arc(21.18,25.74) 20.94,25.38 ; 21.27,29.44 U3.8 ; 21.27,29.44 arc(21.11,28.62) C5.2
$1N11107: length 2.3
  Bottom Layer w0.254: 3.37,33 3.02,33.35 1.18,33.35

## Copper pours and planes (outline as drawn; the poured copper is in the pictures)
+12V on Bottom Layer: 18.39,24.91 18.39,23.55 19.63,23.55 18.83,22.76 18.39,22.76 18.39,22.37 16.44,22.36 16.34,22.27 15.55,22.27 15.54,22.26 15.54,24.58 15.74,24.77 15.74,25.47 15.75,25.48 17.83,25.48
GND on Top Layer: 0,40 0.02,40.18 0.07,40.37 0.17,40.55 0.29,40.71 0.45,40.83 0.63,40.93 0.82,40.98 1,41 23,41 23.18,40.98 23.37,40.93 23.55,40.83 23.71,40.71 23.83,40.55 23.93,40.37 23.98,40.18 24,40 24,1 23.98,0.82 23.93,0.63 23.83,0.45 23.71,0.29 23.55,0.17 23.37,0.07 23.18,0.02 23,0 1,0 0.82,0.02 0.63,0.07 0.45,0.17 0.29,0.29 0.17,0.45 0.07,0.63 0.02,0.82 0,1
GND on Top Layer: 15.06,7.51 13.76,7.51 13.33,7.09 13.33,3.88 15.06,3.88
GND on Top Layer: 1.3,20.77 19.79,20.77 19.79,22.25 19.79,22.25 1.3,22.25
GND on Top Layer: 7.58,7.51 6.27,7.51 5.85,7.09 5.85,3.88 7.58,3.88
GND on Top Layer: 22.43,7.51 21.12,7.51 20.7,7.09 20.7,3.88 22.43,3.88
GND on Bottom Layer: 0,40 0.02,40.18 0.07,40.37 0.17,40.55 0.29,40.71 0.45,40.83 0.63,40.93 0.82,40.98 1,41 23,41 23.18,40.98 23.37,40.93 23.55,40.83 23.71,40.71 23.83,40.55 23.93,40.37 23.98,40.18 24,40 24,1 23.98,0.82 23.93,0.63 23.83,0.45 23.71,0.29 23.55,0.17 23.37,0.07 23.18,0.02 23,0 1,0 0.82,0.02 0.63,0.07 0.45,0.17 0.29,0.29 0.17,0.45 0.07,0.63 0.02,0.82 0,1
GND on Inner1: 0,40 0.02,40.18 0.07,40.37 0.17,40.55 0.29,40.71 0.45,40.83 0.63,40.93 0.82,40.98 1,41 23,41 23.18,40.98 23.37,40.93 23.55,40.83 23.71,40.71 23.83,40.55 23.93,40.37 23.98,40.18 24,40 24,1 23.98,0.82 23.93,0.63 23.83,0.45 23.71,0.29 23.55,0.17 23.37,0.07 23.18,0.02 23,0 1,0 0.82,0.02 0.63,0.07 0.45,0.17 0.29,0.29 0.17,0.45 0.07,0.63 0.02,0.82 0,1
GND on Inner2: 0,40 0.02,40.18 0.07,40.37 0.17,40.55 0.29,40.71 0.45,40.83 0.63,40.93 0.82,40.98 1,41 23,41 23.18,40.98 23.37,40.93 23.55,40.83 23.71,40.71 23.83,40.55 23.93,40.37 23.98,40.18 24,40 24,1 23.98,0.82 23.93,0.63 23.83,0.45 23.71,0.29 23.55,0.17 23.37,0.07 23.18,0.02 23,0 1,0 0.82,0.02 0.63,0.07 0.45,0.17 0.29,0.29 0.17,0.45 0.07,0.63 0.02,0.82 0,1
VBAT on Top Layer: 20.49,22.36 20.49,23.65 20.49,23.65 20.79,23.65 21.98,24.83 23.23,23.58 23.23,22.41 23.19,22.37 20.5,22.37
VBAT on Bottom Layer: 20.38,23.55 21.28,23.55 21.28,23.55 21.58,23.68 21.7,23.98 21.7,24.07 22.91,24.07 22.92,24.06 22.92,22.38 22.9,22.37 21.71,22.37 21.6,22.64 21.32,22.75 20.39,22.75 20.38,22.76 20.38,23.55
V_MOS on Top Layer: 1.54,11.5 1.54,15.61 1.22,15.93 1.22,19.1 1.27,19.16 22.99,19.16 23.24,18.9 23.24,16.87 20.99,14.62 20.99,11.51 16.39,11.51 16.39,15.46 16.09,15.76 13.93,15.76 13.63,15.46 13.63,11.51 9.03,11.51 9.03,15.46 8.73,15.76 6.44,15.76 6.14,15.46 6.14,11.51 1.55,11.51
VS_A on Top Layer: 16.4,3.3 15.68,4.03 15.68,9.75 16.49,10.57 19.61,10.57 19.62,10.56 19.62,9.42 20.41,8.63 20.41,4.03 20.41,4.02 20.41,0.87 16.4,0.87
VS_B on Top Layer: 9.03,3.3 8.31,4.03 8.31,9.75 9.13,10.57 12.24,10.57 12.25,10.56 12.25,9.42 13.04,8.63 13.04,4.03 13.05,4.02 13.05,0.87 9.03,0.87
VS_C on Top Layer: 1.55,3.3 0.82,4.03 0.82,9.75 1.64,10.57 4.76,10.57 4.77,10.56 4.77,9.42 5.56,8.63 5.56,4.03 5.56,4.02 5.56,0.87 1.55,0.87

Small or netless copper shapes (teardrops, artwork), in the pictures only: 73 on Top Layer, 75 on Bottom Layer, 22 on Inner2
